# EAGLE design BreadBox (EAGLE 6.1)
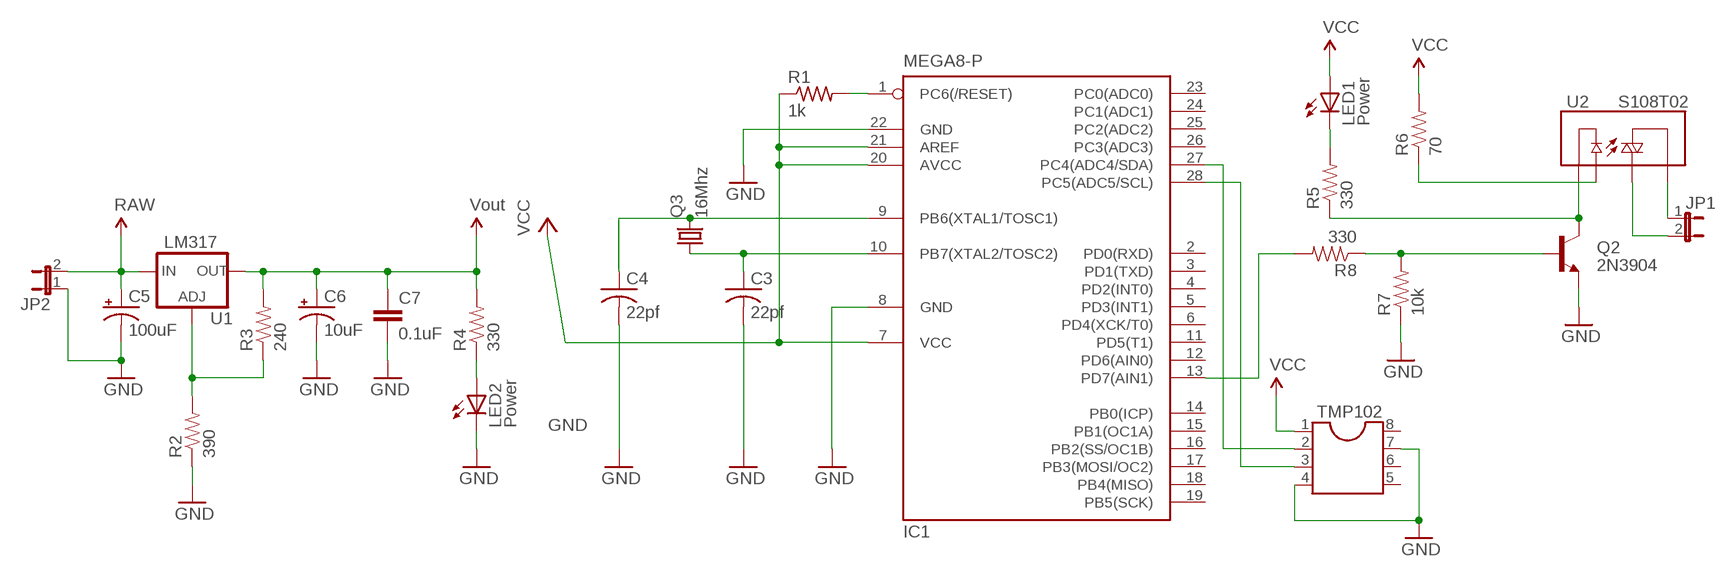
[diagram p0: schematic, sheet 1]

## Parts
C3  22pf  C-US025-024X044  [C025-024X044]
C4  22pf  C-US025-024X044  [C025-024X044]
C5  100uF  CAP_POLPTH1  [CPOL-RADIAL-100UF-25V]
C6  10uF  CAP_POLPTH2  [CPOL-RADIAL-10UF-25V]
C7  0.1uF  CAPPTH2  [CAP-PTH-SMALL2]
IC1  MEGA8-P  [DIL28-3]
JP1  JP1E  [JP1]
JP2  JP1E  [JP1]
LED1  Power  LED5MM  [LED5MM]
LED2  Power  LED5MM  [LED5MM]
Q2  2N3904  TRANSISTOR_NPNTO92  [TO-92]
Q3  16Mhz  CRYSTALHC18U-V  [HC18U-V]
R1  1k  R-US_0207/10  [0207/10]
R2  390  RESISTORPTH1  [AXIAL-0.3]
R3  240  RESISTORPTH1  [AXIAL-0.3]
R4  330  RESISTORPTH1  [AXIAL-0.3]
R5  330  RESISTORPTH1  [AXIAL-0.3]
R6  70  RESISTORPTH1  [AXIAL-0.3]
R7  10k  RESISTORPTH1  [AXIAL-0.3]
R8  330  RESISTORPTH1  [AXIAL-0.3]
TMP102  DIL8S  [SOCKET-08]
U1  LM317  V_REG_317SINK  [TO220-ADJ]
U2  S108T02  RELAY-SOLIDSTATEPTH  [RELAY-S108T02]

## Nets
GND: C3.2 C4.2 C5.2(-) C6.2(-) C7.2 IC1.8(GND) IC1.22(GND) JP2.1 LED2.K(C) Q2.1(E) R2.P$1 R7.P$1 TMP102.4 TMP102.7
N$1: JP1.1 U2.1(T1)
N$2: Q2.2(B) R7.P$2 R8.P$1
N$3: C4.1 IC1.9(PB6(XTAL1/TOSC1)) Q3.2
N$4: Q2.3(C) R5.P$1 U2.4(-)
N$5: C3.1 IC1.10(PB7(XTAL2/TOSC2)) Q3.1
N$6: R2.P$2 R3.P$1 U1.ADJ
N$7: LED2.A R4.P$1
N$8: IC1.1(PC6(/RESET)) R1.2
N$9: R6.P$1 U2.3(+)
N$10: LED1.K(C) R5.P$2
N$11: IC1.13(PD7(AIN1)) R8.P$2
N$12: IC1.28(PC5(ADC5/SCL)) TMP102.3
N$13: IC1.27(PC4(ADC4/SDA)) TMP102.2
N$15: JP1.2 U2.2(T2)
RAW: C5.1(+) JP2.2 U1.IN
VCC: C6.1(+) C7.1 IC1.7(VCC) IC1.20(AVCC) IC1.21(AREF) LED1.A R1.1 R3.P$2 R4.P$2 R6.P$2 TMP102.1 U1.OUT ; supply symbol labelled Vout
Unconnected: IC1.2(PD0(RXD)) IC1.3(PD1(TXD)) IC1.4(PD2(INT0)) IC1.5(PD3(INT1)) IC1.6(PD4(XCK/T0)) IC1.11(PD5(T1)) IC1.12(PD6(AIN0)) IC1.14(PB0(ICP)) IC1.15(PB1(OC1A)) IC1.16(PB2(SS/OC1B)) IC1.17(PB3(MOSI/OC2)) IC1.18(PB4(MISO)) IC1.19(PB5(SCK)) IC1.23(PC0(ADC0)) IC1.24(PC1(ADC1)) IC1.25(PC2(ADC2)) IC1.26(PC3(ADC3)) TMP102.5 TMP102.6 TMP102.8

## Library data of the parts
C3 C4 = resistor:C-US: CAPACITOR, American symbol
C5 C6 = SparkFun:CAP_POL: Capacitor Polarized These are standard SMD and PTH capacitors. Normally 10uF, 47uF, and 100uF in electrolytic and tantalum varieties. Always verify the external diameter of the through hole cap, it varies with capacity, voltage, and manufacturer. The EIA devices should be standard.
C7 = SparkFun:CAP: Capacitor Standard 0603 ceramic capacitor, and 0.1" leaded capacitor.
IC1 = atmel:MEGA8-P: MICROCONTROLLER 8 Kbytes FLASH, 1 kbytes SRAM, 512 bytes EEPROM, USART, 4-channel 10 bit ADC, 2-channel 8 bit ADC Pin compatible with Atmega48, ATMega88, ATMega168 Source: avr.lbr; OC_FARNELL: unknown; OC_NEWARK: unknown
JP1 JP2 = jumper:JP1E: JUMPER
LED1 LED2 = SparkFun-Nate:LED
Q2 = SparkFun:TRANSISTOR_NPN: Transistor NPN BJT configuration in SOT23 package. MMBT2222 is the common NPN we use. Double check BCE configuration again layout.
Q3 = crystal:CRYSTAL: CRYSTAL; OC_FARNELL: unknown; OC_NEWARK: unknown
R1 = resistor:R-US_: RESISTOR, American symbol
R2-R8 = SparkFun:RESISTOR: Resistor Basic schematic elements and footprints for 0603, 1206, and PTH 1/10th watt (small) resistors.
TMP102 = ic-package:DIL8: Dual In Line / Socket
U1 = SparkFun:V_REG_317: Voltage Regulator Standard LM317 adjustable voltage regulator. AOI (Adjust Output Input). Google 'LM317 Calculator' for easy to use app to get the two resistor values needed. 240/720 for 5V output. 240/390 for 3.3V output. Spark Fun Electronics SKU : COM-00527
U2 = SparkFun:RELAY-SOLIDSTATE

## Net classes
0 default: width 0.254 mm

## Board
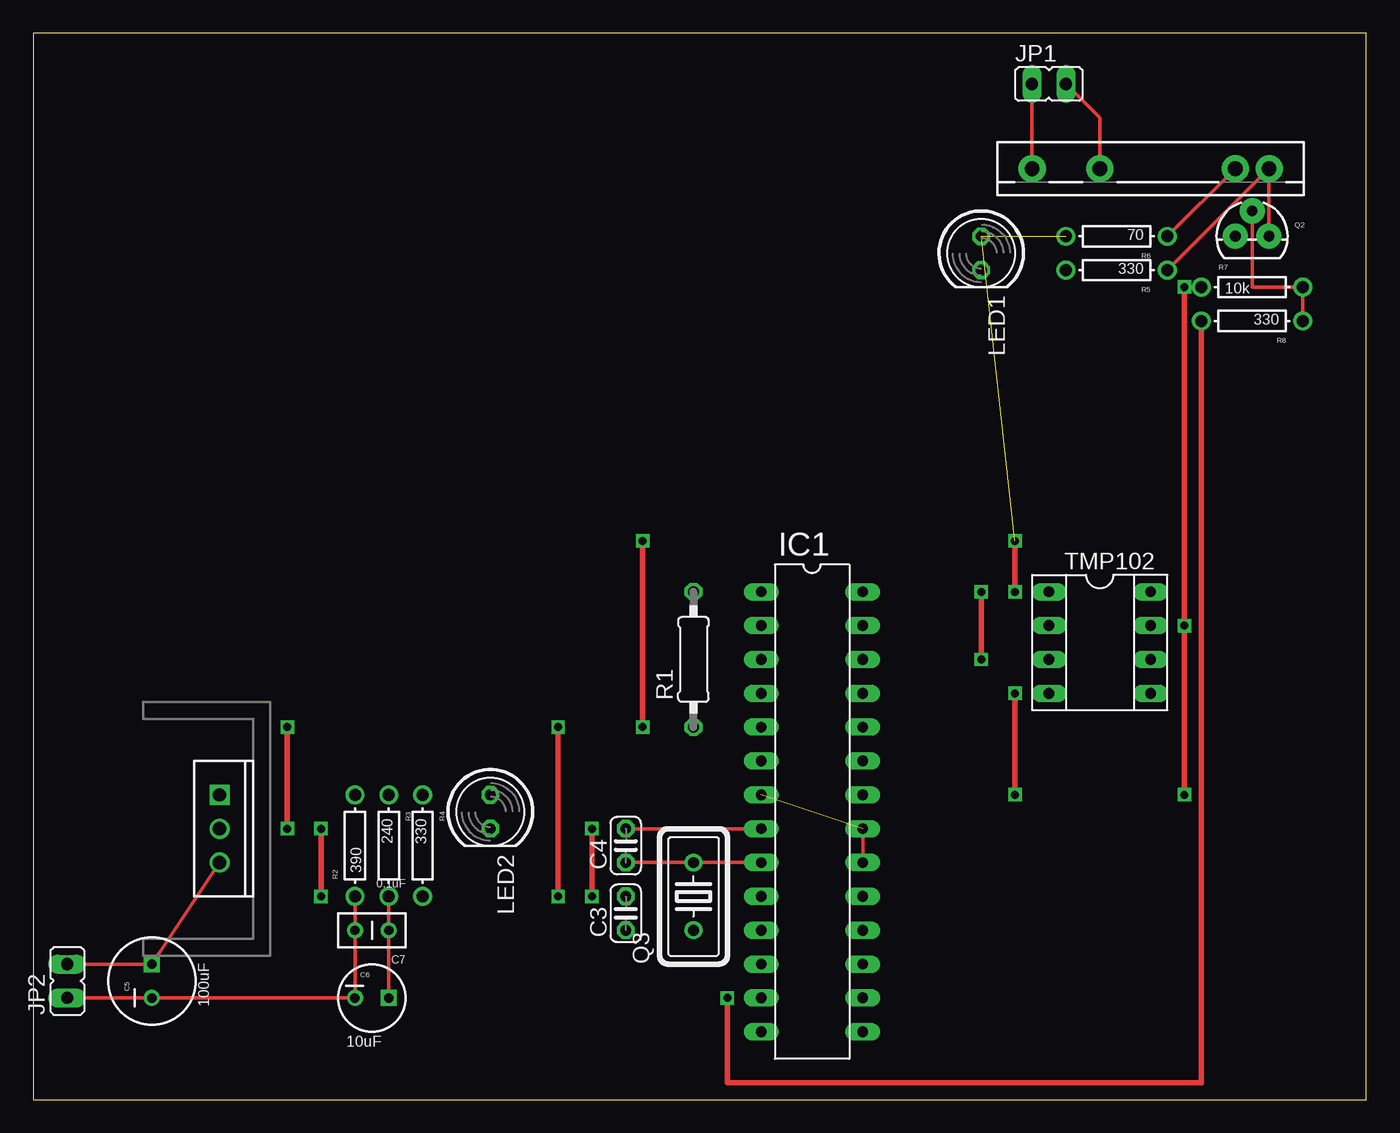
[diagram p1: board, top side]
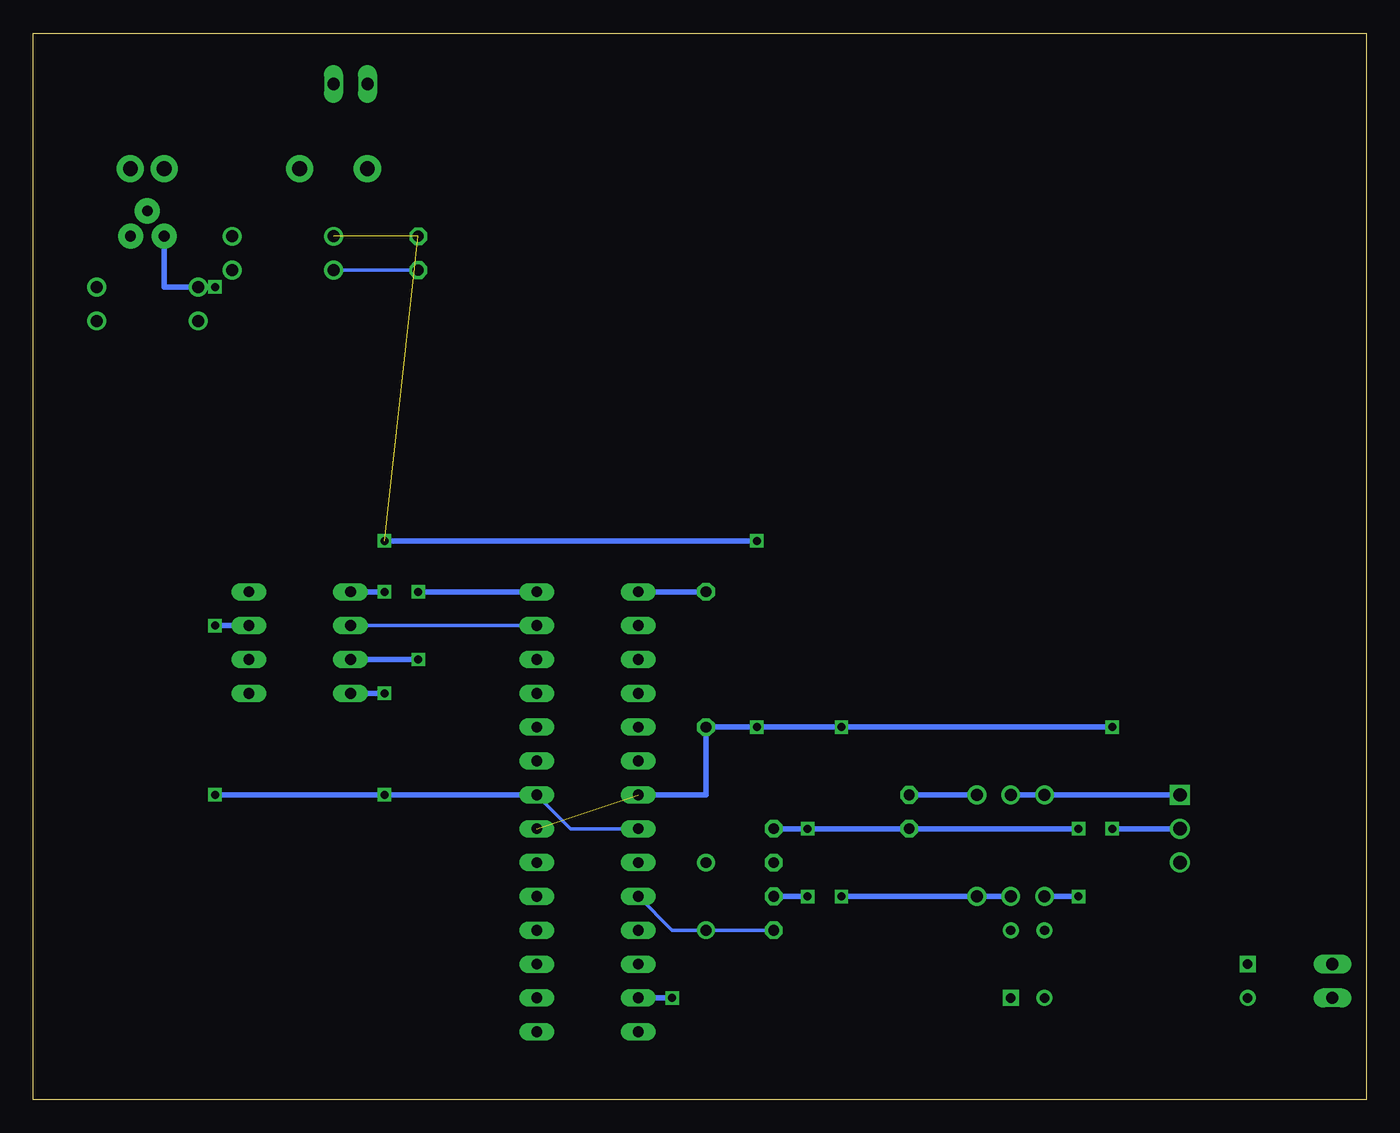
[diagram p2: board, bottom side, seen from below]

Size 100 x 80 mm. Coordinates in mm from the lower left corner, seen from the top.
Outline: 0,0 100,0 100,80 0,80 0,0
Copper layers (1*16): Top 0.035mm / dielectric 1.5mm / Bottom 0.035mm
Design rules: minimum track width 10mil, minimum drill 24mil, track to track 8mil, track to pad 8mil, pad to pad 8mil, via to via 8mil, smd to smd 8mil, copper to edge 40mil, drill to drill 8mil, minimum pad ring 10mil, minimum via ring 8mil, stop-mask expansion 4mil, vias tented up to drill 0mil, thermal gap 10mil

### Footprints (pad centres in the part's own frame; a part is rotated, then mirrored left to right if it is on the bottom)
C025-024X044 = drill 0.813 octagon: 1 -1.27,0; 2 1.27,0
CPOL-RADIAL-100UF-25V = drill 0.7 square: 1 1.27,0 | drill 0.7: 2 -1.27,0
CPOL-RADIAL-10UF-25V = drill 0.7 square: 1 1.27,0 | drill 0.7: 2 -1.27,0
CAP-PTH-SMALL2 = drill 0.7: 1 0,0; 2 2.54,0
DIL28-3 = drill 0.813 long: 1 -16.51,-3.81; 2 -13.97,-3.81; 3 -11.43,-3.81; 4 -8.89,-3.81; 5 -6.35,-3.81; 6 -3.81,-3.81; 7 -1.27,-3.81; 8 1.27,-3.81; 9 3.81,-3.81; 10 6.35,-3.81; 11 8.89,-3.81; 12 11.43,-3.81; 13 13.97,-3.81; 14 16.51,-3.81; 15 16.51,3.81; 16 13.97,3.81; 17 11.43,3.81; 18 8.89,3.81; 19 6.35,3.81; 20 3.81,3.81; 21 1.27,3.81; 22 -1.27,3.81; 23 -3.81,3.81; 24 -6.35,3.81; 25 -8.89,3.81; 26 -11.43,3.81; 27 -13.97,3.81; 28 -16.51,3.81
JP1 = drill 0.914 long: 1 0,-1.27; 2 0,1.27
LED5MM = drill 0.813 octagon: A -1.27,0; K 1.27,0
TO-92 = drill 0.813 pad 1.88: 1 -1.27,0; 2 0,1.905; 3 1.27,0
HC18U-V = drill 0.813: 1 -2.54,0; 2 2.54,0
0207/10 = drill 0.813 octagon: 1 -5.08,0; 2 5.08,0
AXIAL-0.3 = drill 0.9: P$1 -3.81,0; P$2 3.81,0
SOCKET-08 = drill 0.813 long: 1 -3.81,-3.81; 2 -1.27,-3.81; 3 1.27,-3.81; 4 3.81,-3.81; 5 3.81,3.81; 6 1.27,3.81; 7 -1.27,3.81; 8 -3.81,3.81
TO220-ADJ = drill 1 square: ADJ -2.54,0 | drill 1: IN 2.54,0; OUT 0,0
RELAY-S108T02 = drill 1.1 pad 2.032: 1 -8.88,0; 2 -3.8,0; 3 6.36,0; 4 8.9,0

### Placement (x,y rotation side)
C3  44.45,13.97 90 top
C4  44.45,19.05 90 top
C5  8.89,8.89 90 top
C6  25.4,7.62 0 top
C7  26.67,12.7 180 top
IC1  58.42,21.59 270 top
JP1  76.2,76.2 270 top
JP2  2.54,8.89 0 top
LED1  71.12,63.5 270 top
LED2  34.29,21.59 270 top
Q2  91.44,64.77 0 top
Q3  49.53,15.24 90 top
R1  49.53,33.02 90 top
R2  24.13,19.05 90 top
R3  26.67,19.05 270 top
R4  29.21,19.05 270 top
R5  81.28,62.23 180 top
R6  81.28,64.77 180 top
R7  91.44,60.96 0 top
R8  91.44,58.42 180 top
TMP102  80.01,34.29 270 top
U1  13.97,20.32 270 top
U2  83.82,69.85 0 top

### Tracks (layer width: path | path; a pad name or v marks a point on that pad's centre or on a via)
GND  (via drill 0.6)
  Top 0.254: JP2.1 C5.2 C6.2 C7.2 R2.P$1 | IC1.8 C4.2
  Top 0.406: v41.91,15.24 v41.91,20.32 | v21.59,20.32 v21.59,15.24 | v73.66,30.48 v73.66,22.86 | v86.36,22.86 v86.36,35.56 v86.36,60.96
  Bottom 0.254: IC1.22 59.69,20.32 IC1.8
  Bottom 0.406: C3.2 v41.91,15.24 | C4.2 v41.91,20.32 LED2.K v21.59,20.32 | v21.59,15.24 R2.P$1 | IC1.22 v73.66,22.86 v86.36,22.86 | TMP102.4 v73.66,30.48 | TMP102.7 v86.36,35.56 | v86.36,60.96 R7.P$1 90.17,60.96 Q2.1
N$1
  Top 0.254: JP1.1 U2.1
N$2
  Top 0.254: R8.P$1 R7.P$2 91.44,60.96 Q2.2
N$3
  Top 0.254: C4.1 Q3.2 IC1.9
N$4
  Top 0.254: U2.4 R5.P$1 | U2.4 Q2.3 | U2.4
N$5
  Bottom 0.254: C3.1 Q3.1 52.07,12.7 IC1.10
N$6
  Bottom 0.406: U1.ADJ R2.P$2 R3.P$1
N$7
  Bottom 0.406: R4.P$1 LED2.A
N$8
  Bottom 0.406: R1.2 IC1.1
N$9
  Top 0.254: R6.P$1 U2.3
N$10
  Bottom 0.254: R5.P$2 LED1.K
N$11  (via drill 0.6)
  Top 0.406: v52.07,7.62 52.07,1.27 87.63,1.27 R8.P$2
  Bottom 0.406: IC1.13 v52.07,7.62
N$12  (via drill 0.6)
  Top 0.406: v71.12,38.1 v71.12,33.02
  Bottom 0.406: IC1.28 v71.12,38.1 | v71.12,33.02 TMP102.3
N$13
  Bottom 0.254: TMP102.2 IC1.27
N$15
  Top 0.254: JP1.2 80.01,73.66 U2.2
RAW
  Top 0.254: JP2.2 C5.1 U1.IN
VCC  (via drill 0.6)  (3 unrouted)
  Top 0.254: IC1.21 IC1.20 | C6.1 C7.1 R3.P$2
  Top 0.406: v39.37,15.24 v39.37,27.94 | v19.05,27.94 v19.05,20.32 | v73.66,38.1 v73.66,41.91 | v45.72,41.91 v45.72,27.94
  Bottom 0.406: v19.05,27.94 v39.37,27.94 v45.72,27.94 R1.1 49.53,22.86 IC1.7 | v19.05,20.32 U1.OUT | TMP102.1 v73.66,38.1 | v73.66,41.91 v45.72,41.91 | v39.37,15.24 R4.P$2 R3.P$2 v39.37,15.24